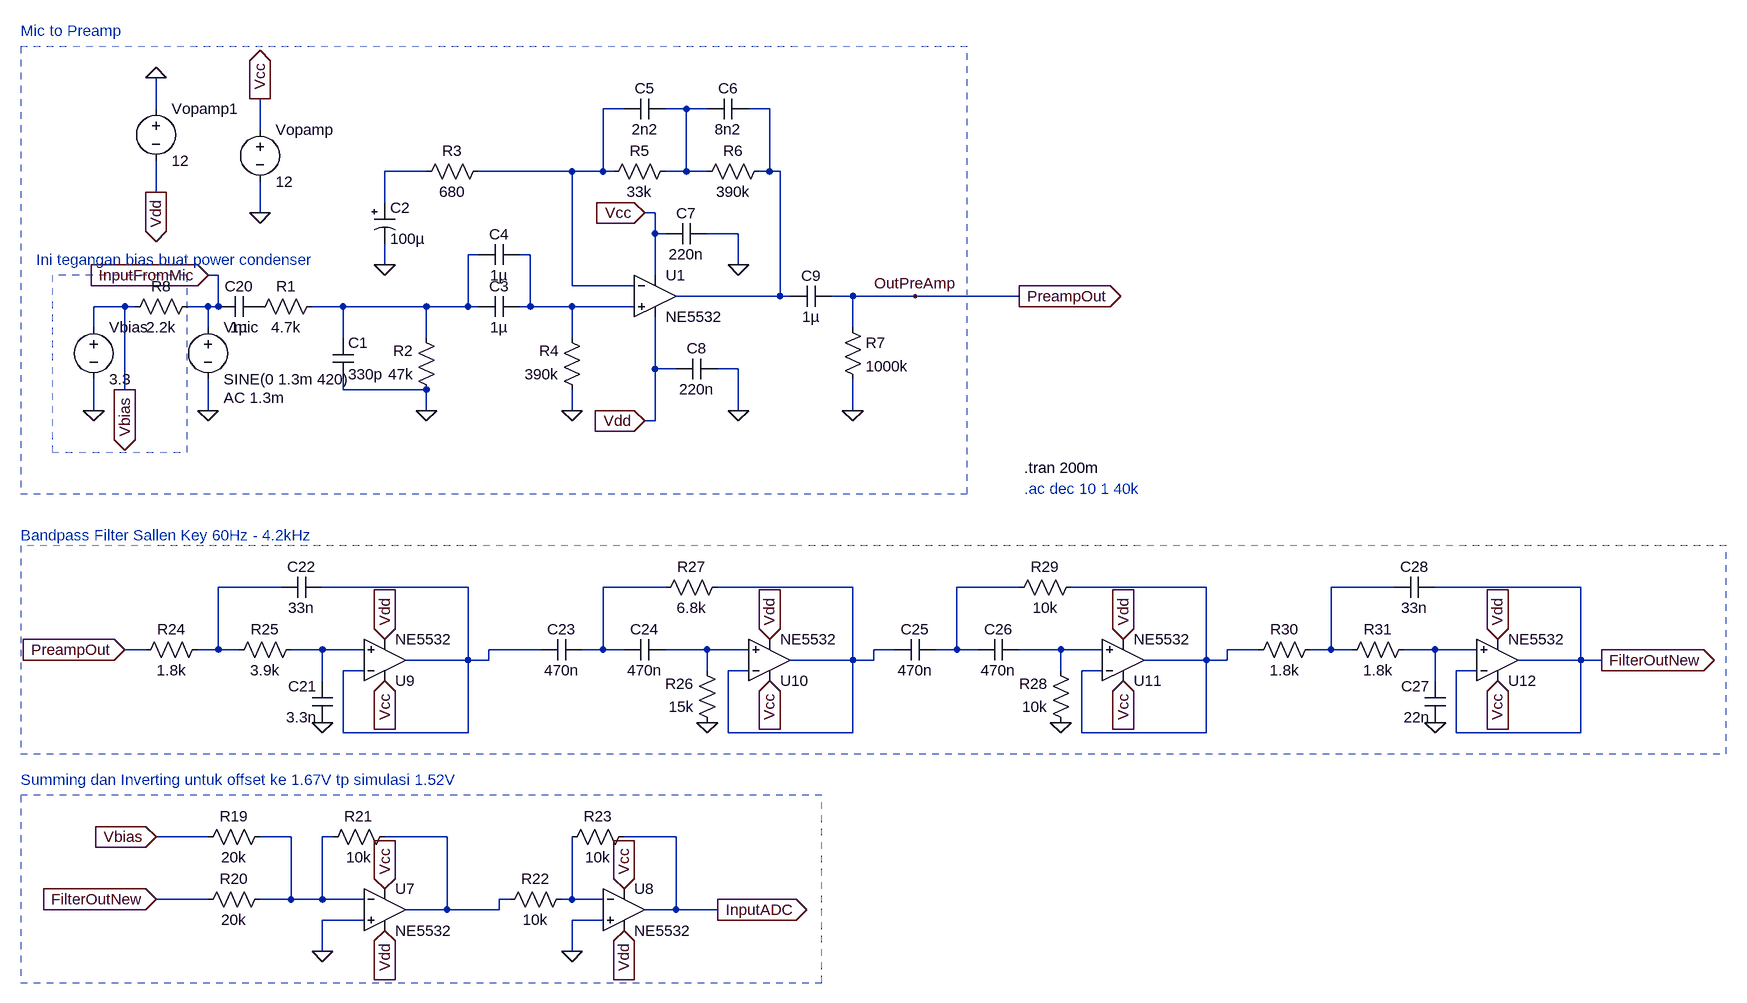
[diagram p0: schematic electret_amplify_filter.asc]
electret_amplify_filter.asc, the LTspice schematic file:
Version 4
SHEET 1 3736 1860
WIRE 224 -288 224 -336
WIRE 944 -288 912 -288
WIRE 1040 -288 1008 -288
WIRE 1072 -288 1040 -288
WIRE 1168 -288 1136 -288
WIRE 384 -256 384 -304
WIRE 640 -192 576 -192
WIRE 864 -192 720 -192
WIRE 912 -192 912 -288
WIRE 912 -192 864 -192
WIRE 928 -192 912 -192
WIRE 1040 -192 1040 -288
WIRE 1040 -192 1008 -192
WIRE 1072 -192 1040 -192
WIRE 1168 -192 1168 -288
WIRE 1168 -192 1152 -192
WIRE 1184 -192 1168 -192
WIRE 224 -160 224 -208
WIRE 576 -144 576 -192
WIRE 384 -128 384 -176
WIRE 992 -128 976 -128
WIRE 992 -96 992 -128
WIRE 1008 -96 992 -96
WIRE 1120 -96 1072 -96
WIRE 720 -64 704 -64
WIRE 800 -64 784 -64
WIRE 576 -48 576 -80
WIRE 1120 -48 1120 -96
WIRE 320 -32 304 -32
WIRE 992 -32 992 -96
WIRE 864 -16 864 -192
WIRE 960 -16 864 -16
WIRE 1184 0 1184 -192
WIRE 1184 0 1024 0
WIRE 1200 0 1184 0
WIRE 1296 0 1264 0
WIRE 1392 0 1296 0
WIRE 1552 0 1392 0
WIRE 176 16 128 16
WIRE 192 16 176 16
WIRE 304 16 272 16
WIRE 320 16 320 -32
WIRE 320 16 304 16
WIRE 512 16 464 16
WIRE 640 16 512 16
WIRE 704 16 704 -64
WIRE 704 16 640 16
WIRE 720 16 704 16
WIRE 800 16 800 -64
WIRE 800 16 784 16
WIRE 864 16 800 16
WIRE 960 16 864 16
WIRE 128 48 128 16
WIRE 304 48 304 16
WIRE 1296 48 1296 0
WIRE 512 64 512 16
WIRE 640 64 640 16
WIRE 864 64 864 16
WIRE 992 112 992 32
WIRE 1024 112 992 112
WIRE 1120 112 1088 112
WIRE 176 144 176 16
WIRE 512 144 512 128
WIRE 640 144 512 144
WIRE 128 176 128 128
WIRE 304 176 304 128
WIRE 640 176 640 144
WIRE 864 176 864 144
WIRE 1120 176 1120 112
WIRE 1296 176 1296 128
WIRE 992 192 992 112
WIRE 992 192 976 192
WIRE 416 448 320 448
WIRE 704 448 480 448
WIRE 1008 448 912 448
WIRE 1296 448 1088 448
WIRE 1552 448 1456 448
WIRE 1840 448 1632 448
WIRE 2128 448 2032 448
WIRE 2416 448 2192 448
WIRE 208 544 176 544
WIRE 320 544 320 448
WIRE 320 544 288 544
WIRE 352 544 320 544
WIRE 480 544 432 544
WIRE 544 544 480 544
WIRE 816 544 736 544
WIRE 912 544 912 448
WIRE 912 544 880 544
WIRE 944 544 912 544
WIRE 1072 544 1008 544
WIRE 1136 544 1072 544
WIRE 1360 544 1328 544
WIRE 1456 544 1456 448
WIRE 1456 544 1424 544
WIRE 1488 544 1456 544
WIRE 1616 544 1552 544
WIRE 1680 544 1616 544
WIRE 1920 544 1872 544
WIRE 2032 544 2032 448
WIRE 2032 544 2000 544
WIRE 2064 544 2032 544
WIRE 2192 544 2144 544
WIRE 2256 544 2192 544
WIRE 704 560 704 448
WIRE 704 560 608 560
WIRE 736 560 736 544
WIRE 736 560 704 560
WIRE 1296 560 1296 448
WIRE 1296 560 1200 560
WIRE 1328 560 1328 544
WIRE 1328 560 1296 560
WIRE 1840 560 1840 448
WIRE 1840 560 1744 560
WIRE 1872 560 1872 544
WIRE 1872 560 1840 560
WIRE 2416 560 2416 448
WIRE 2416 560 2320 560
WIRE 2448 560 2416 560
WIRE 544 576 512 576
WIRE 1072 576 1072 544
WIRE 1136 576 1104 576
WIRE 1616 576 1616 544
WIRE 1680 576 1648 576
WIRE 2256 576 2224 576
WIRE 480 592 480 544
WIRE 2192 592 2192 544
WIRE 512 672 512 576
WIRE 704 672 704 560
WIRE 704 672 512 672
WIRE 1104 672 1104 576
WIRE 1296 672 1296 560
WIRE 1296 672 1104 672
WIRE 1648 672 1648 576
WIRE 1840 672 1840 560
WIRE 1840 672 1648 672
WIRE 2224 672 2224 576
WIRE 2416 672 2416 560
WIRE 2416 672 2224 672
WIRE 304 832 224 832
WIRE 432 832 384 832
WIRE 496 832 480 832
WIRE 672 832 576 832
WIRE 1024 832 944 832
WIRE 304 928 224 928
WIRE 432 928 432 832
WIRE 432 928 384 928
WIRE 480 928 480 832
WIRE 480 928 432 928
WIRE 544 928 480 928
WIRE 768 928 752 928
WIRE 864 928 864 832
WIRE 864 928 848 928
WIRE 912 928 864 928
WIRE 672 944 672 832
WIRE 672 944 608 944
WIRE 752 944 752 928
WIRE 752 944 672 944
WIRE 1024 944 1024 832
WIRE 1024 944 976 944
WIRE 1088 944 1024 944
WIRE 544 960 480 960
WIRE 912 960 864 960
WIRE 480 1008 480 960
WIRE 864 1008 864 960
FLAG 304 176 0
FLAG 640 176 0
FLAG 864 176 0
FLAG 1120 176 0
FLAG 1296 176 0
FLAG 1120 -48 0
FLAG 576 -48 0
FLAG 976 -128 Vcc
IOPIN 976 -128 In
FLAG 976 192 Vdd
IOPIN 976 192 In
FLAG 384 -304 Vcc
IOPIN 384 -304 Out
FLAG 224 -160 Vdd
IOPIN 224 -160 Out
FLAG 1392 0 OutPreAmp
FLAG 384 -128 0
FLAG 224 -336 0
FLAG 128 176 0
FLAG 1552 0 PreampOut
IOPIN 1552 0 Out
FLAG 176 144 Vbias
IOPIN 176 144 Out
FLAG 224 832 Vbias
IOPIN 224 832 In
FLAG 224 928 FilterOutNew
IOPIN 224 928 In
FLAG 576 912 Vcc
IOPIN 576 912 In
FLAG 576 976 Vdd
IOPIN 576 976 In
FLAG 480 1008 0
FLAG 1088 944 InputADC
IOPIN 1088 944 Out
FLAG 944 912 Vcc
IOPIN 944 912 In
FLAG 944 976 Vdd
IOPIN 944 976 In
FLAG 864 1008 0
FLAG 576 592 Vcc
IOPIN 576 592 In
FLAG 576 528 Vdd
IOPIN 576 528 In
FLAG 480 656 0
FLAG 1168 592 Vcc
IOPIN 1168 592 In
FLAG 1168 528 Vdd
IOPIN 1168 528 In
FLAG 1072 656 0
FLAG 1712 592 Vcc
IOPIN 1712 592 In
FLAG 1712 528 Vdd
IOPIN 1712 528 In
FLAG 1616 656 0
FLAG 2288 592 Vcc
IOPIN 2288 592 In
FLAG 2288 528 Vdd
IOPIN 2288 528 In
FLAG 2192 656 0
FLAG 176 544 PreampOut
IOPIN 176 544 In
FLAG 2448 560 FilterOutNew
IOPIN 2448 560 Out
FLAG 304 -32 InputFromMic
IOPIN 304 -32 In
SYMBOL res 480 0 R90
WINDOW 0 0 56 VBottom 2
WINDOW 3 32 56 VTop 2
SYMATTR InstName R1
SYMATTR Value 4.7k
SYMBOL res 656 160 R180
WINDOW 0 36 76 Left 2
WINDOW 3 36 40 Left 2
SYMATTR InstName R2
SYMATTR Value 47k
SYMBOL res 736 -208 R90
WINDOW 0 0 56 VBottom 2
WINDOW 3 32 56 VTop 2
SYMATTR InstName R3
SYMATTR Value 680
SYMBOL res 880 160 R180
WINDOW 0 36 76 Left 2
WINDOW 3 36 40 Left 2
SYMATTR InstName R4
SYMATTR Value 390k
SYMBOL res 912 -176 R270
WINDOW 0 32 56 VTop 2
WINDOW 3 0 56 VBottom 2
SYMATTR InstName R5
SYMATTR Value 33k
SYMBOL res 1056 -176 R270
WINDOW 0 32 56 VTop 2
WINDOW 3 0 56 VBottom 2
SYMATTR InstName R6
SYMATTR Value 390k
SYMBOL res 1280 32 R0
SYMATTR InstName R7
SYMATTR Value 1000k
SYMBOL cap 496 64 R0
SYMATTR InstName C1
SYMATTR Value 330p
SYMBOL cap 784 0 R90
WINDOW 0 0 32 VBottom 2
WINDOW 3 32 32 VTop 2
SYMATTR InstName C3
SYMATTR Value 1µ
SYMBOL cap 784 -80 R90
WINDOW 0 0 32 VBottom 2
WINDOW 3 32 32 VTop 2
SYMATTR InstName C4
SYMATTR Value 1µ
SYMBOL cap 1008 -304 R90
WINDOW 0 0 32 VBottom 2
WINDOW 3 32 32 VTop 2
SYMATTR InstName C5
SYMATTR Value 2n2
SYMBOL cap 1136 -304 R90
WINDOW 0 0 32 VBottom 2
WINDOW 3 32 32 VTop 2
SYMATTR InstName C6
SYMATTR Value 8n2
SYMBOL cap 1072 -112 R90
WINDOW 0 0 32 VBottom 2
WINDOW 3 32 32 VTop 2
SYMATTR InstName C7
SYMATTR Value 220n
SYMBOL cap 1088 96 R90
WINDOW 0 0 32 VBottom 2
WINDOW 3 32 32 VTop 2
SYMATTR InstName C8
SYMATTR Value 220n
SYMBOL cap 1264 -16 R90
WINDOW 0 0 32 VBottom 2
WINDOW 3 32 32 VTop 2
SYMATTR InstName C9
SYMATTR Value 1µ
SYMBOL voltage 384 -272 R0
SYMATTR InstName Vopamp
SYMATTR Value 12
SYMBOL polcap 560 -144 R0
SYMATTR InstName C2
SYMATTR Value 100µ
SYMATTR SpiceLine V=3
SYMBOL voltage 304 32 R0
WINDOW 123 24 124 Left 2
WINDOW 39 0 0 Left 0
SYMATTR Value2 AC 1.3m
SYMATTR InstName Vmic
SYMATTR Value SINE(0 1.3m 420)
SYMBOL voltage 224 -304 R0
SYMATTR InstName Vopamp1
SYMATTR Value 12
SYMBOL voltage 128 32 R0
SYMATTR InstName Vbias
SYMATTR Value 3.3
SYMBOL res 288 0 R90
WINDOW 0 0 56 VBottom 2
WINDOW 3 32 56 VTop 2
SYMATTR InstName R8
SYMATTR Value 2.2k
SYMBOL ZZZ\\OpAmp\\NE5532 992 0 R0
SYMATTR InstName U1
SYMBOL cap 384 0 R90
WINDOW 0 0 32 VBottom 2
WINDOW 3 32 32 VTop 2
SYMATTR InstName C20
SYMATTR Value 1µ
SYMBOL res 400 816 R90
WINDOW 0 0 56 VBottom 2
WINDOW 3 32 56 VTop 2
SYMATTR InstName R19
SYMATTR Value 20k
SYMBOL res 400 912 R90
WINDOW 0 0 56 VBottom 2
WINDOW 3 32 56 VTop 2
SYMATTR InstName R20
SYMATTR Value 20k
SYMBOL res 592 816 R90
WINDOW 0 0 56 VBottom 2
WINDOW 3 32 56 VTop 2
SYMATTR InstName R21
SYMATTR Value 10k
SYMBOL ZZZ\\OpAmp\\NE5532 576 944 R0
SYMATTR InstName U7
SYMBOL ZZZ\\OpAmp\\NE5532 944 944 R0
SYMATTR InstName U8
SYMBOL res 864 912 R90
WINDOW 0 0 56 VBottom 2
WINDOW 3 32 56 VTop 2
SYMATTR InstName R22
SYMATTR Value 10k
SYMBOL res 960 816 R90
WINDOW 0 0 56 VBottom 2
WINDOW 3 32 56 VTop 2
SYMATTR InstName R23
SYMATTR Value 10k
SYMBOL res 304 528 R90
WINDOW 0 0 56 VBottom 2
WINDOW 3 32 56 VTop 2
SYMATTR InstName R24
SYMATTR Value 1.8k
SYMBOL res 448 528 R90
WINDOW 0 0 56 VBottom 2
WINDOW 3 32 56 VTop 2
SYMATTR InstName R25
SYMATTR Value 3.9k
SYMBOL cap 496 656 R180
WINDOW 0 24 56 Left 2
WINDOW 3 24 8 Left 2
SYMATTR InstName C21
SYMATTR Value 3.3n
SYMBOL cap 480 432 R90
WINDOW 0 0 32 VBottom 2
WINDOW 3 32 32 VTop 2
SYMATTR InstName C22
SYMATTR Value 33n
SYMBOL ZZZ\\OpAmp\\NE5532 576 560 M180
SYMATTR InstName U9
SYMBOL res 1088 672 R180
WINDOW 0 36 76 Left 2
WINDOW 3 36 40 Left 2
SYMATTR InstName R26
SYMATTR Value 15k
SYMBOL res 1104 432 R90
WINDOW 0 0 56 VBottom 2
WINDOW 3 32 56 VTop 2
SYMATTR InstName R27
SYMATTR Value 6.8k
SYMBOL cap 816 560 R270
WINDOW 0 32 32 VTop 2
WINDOW 3 0 32 VBottom 2
SYMATTR InstName C23
SYMATTR Value 470n
SYMBOL cap 944 560 R270
WINDOW 0 32 32 VTop 2
WINDOW 3 0 32 VBottom 2
SYMATTR InstName C24
SYMATTR Value 470n
SYMBOL ZZZ\\OpAmp\\NE5532 1168 560 M180
SYMATTR InstName U10
SYMBOL res 1632 672 R180
WINDOW 0 36 76 Left 2
WINDOW 3 36 40 Left 2
SYMATTR InstName R28
SYMATTR Value 10k
SYMBOL res 1648 432 R90
WINDOW 0 0 56 VBottom 2
WINDOW 3 32 56 VTop 2
SYMATTR InstName R29
SYMATTR Value 10k
SYMBOL cap 1360 560 R270
WINDOW 0 32 32 VTop 2
WINDOW 3 0 32 VBottom 2
SYMATTR InstName C25
SYMATTR Value 470n
SYMBOL cap 1488 560 R270
WINDOW 0 32 32 VTop 2
WINDOW 3 0 32 VBottom 2
SYMATTR InstName C26
SYMATTR Value 470n
SYMBOL ZZZ\\OpAmp\\NE5532 1712 560 M180
SYMATTR InstName U11
SYMBOL res 2016 528 R90
WINDOW 0 0 56 VBottom 2
WINDOW 3 32 56 VTop 2
SYMATTR InstName R30
SYMATTR Value 1.8k
SYMBOL res 2160 528 R90
WINDOW 0 0 56 VBottom 2
WINDOW 3 32 56 VTop 2
SYMATTR InstName R31
SYMATTR Value 1.8k
SYMBOL cap 2208 656 R180
WINDOW 0 24 56 Left 2
WINDOW 3 24 8 Left 2
SYMATTR InstName C27
SYMATTR Value 22n
SYMBOL cap 2192 432 R90
WINDOW 0 0 32 VBottom 2
WINDOW 3 32 32 VTop 2
SYMATTR InstName C28
SYMATTR Value 33n
SYMBOL ZZZ\\OpAmp\\NE5532 2288 560 M180
SYMATTR InstName U12
TEXT 1560 264 Left 2 !.tran 200m
TEXT 40 -56 Left 2 ;Ini tegangan bias buat power condenser
TEXT 16 -408 Left 2 ;Mic to Preamp
TEXT 1560 296 Left 2 ;.ac dec 10 1 40k
TEXT 16 744 Left 2 ;Summing dan Inverting untuk offset ke 1.67V tp simulasi 1.52V
TEXT 16 368 Left 2 ;Bandpass Filter Sallen Key 60Hz - 4.2kHz
RECTANGLE Normal 272 -32 64 240 2
RECTANGLE Normal 1472 -384 16 304 1
RECTANGLE Normal 1248 768 16 1056 1
RECTANGLE Normal 2640 384 16 704 1

The netlist it stands for:
* electret_amplify_filter.asc
R1 N005 P001 4.7k
R2 0 N005 47k
R3 N001 N004 680
R4 0 N006 390k
R5 N001 N002 33k
R6 N002 N003 390k
R7 PreampOut 0 1000k
C1 N005 0 330p
C3 N006 N005 1µ
C4 N006 N005 1µ
C5 N002 N001 2n2
C6 N003 N002 8n2
C7 0 Vcc 220n
C8 0 Vdd 220n
C9 PreampOut N003 1µ
Vopamp Vcc 0 12
C2 N004 0 100µ V=3
Vmic InputFromMic 0 SINE(0 1.3m 420) AC 1.3m
Vopamp1 0 Vdd 12
Vbias Vbias 0 3.3
R8 InputFromMic Vbias 2.2k
XU1 N006 N001 Vcc Vdd N003 NE5532  ; pins In+ In- V+ V- OUT
C20 P001 InputFromMic 1µ
R19 N018 Vbias 20k
R20 N018 FilterOutNew 20k
R21 N019 N018 10k
XU7 0 N018 Vcc Vdd N019 NE5532  ; pins In+ In- V+ V- OUT
XU8 0 N020 Vcc Vdd InputADC NE5532  ; pins In+ In- V+ V- OUT
R22 N020 N019 10k
R23 InputADC N020 10k
R24 N007 PreampOut 1.8k
R25 N014 N007 3.9k
C21 0 N014 3.3n
C22 N008 N007 33n
XU9 N014 N008 Vcc Vdd N008 NE5532  ; pins In+ In- V+ V- OUT
R26 0 N015 15k
R27 N010 N009 6.8k
C23 N008 N009 470n
C24 N009 N015 470n
XU10 N015 N010 Vcc Vdd N010 NE5532  ; pins In+ In- V+ V- OUT
R28 0 N016 10k
R29 N012 N011 10k
C25 N010 N011 470n
C26 N011 N016 470n
XU11 N016 N012 Vcc Vdd N012 NE5532  ; pins In+ In- V+ V- OUT
R30 N013 N012 1.8k
R31 N017 N013 1.8k
C27 0 N017 22n
C28 FilterOutNew N013 33n
XU12 N017 FilterOutNew Vcc Vdd FilterOutNew NE5532  ; pins In+ In- V+ V- OUT
.tran 200m
* Ini tegangan bias buat power condenser
* Mic to Preamp
* .ac dec 10 1 40k
* Summing dan Inverting untuk offset ke 1.67V tp simulasi 1.52V
* Bandpass Filter Sallen Key 60Hz - 4.2kHz
.backanno
.end